# Altium schematic sheet ADC.SchDoc
size 420 x 297 mm; Address1: Address1; Address2: Address2; Address3: Address3; Address4: Address4; SheetNumber: 1; SheetTotal: 2; Scale: 1:1; Разраб.: Иванов; Обозначение документа: АБВГ.123456.001 Э3; Пров.: Петров; Утв.: Сидоров; Наименование организации: ОАО "Ваша фирма"; Перв. применение: АБВГ.123456.000; Наименование изделия 1: Плата; Наименование изделия 2: Схема электрическая; Наименование изделия 3: принципиальная; Нач. отд.: Нач. отд.; Фамилия нач. отд.: Сидоров
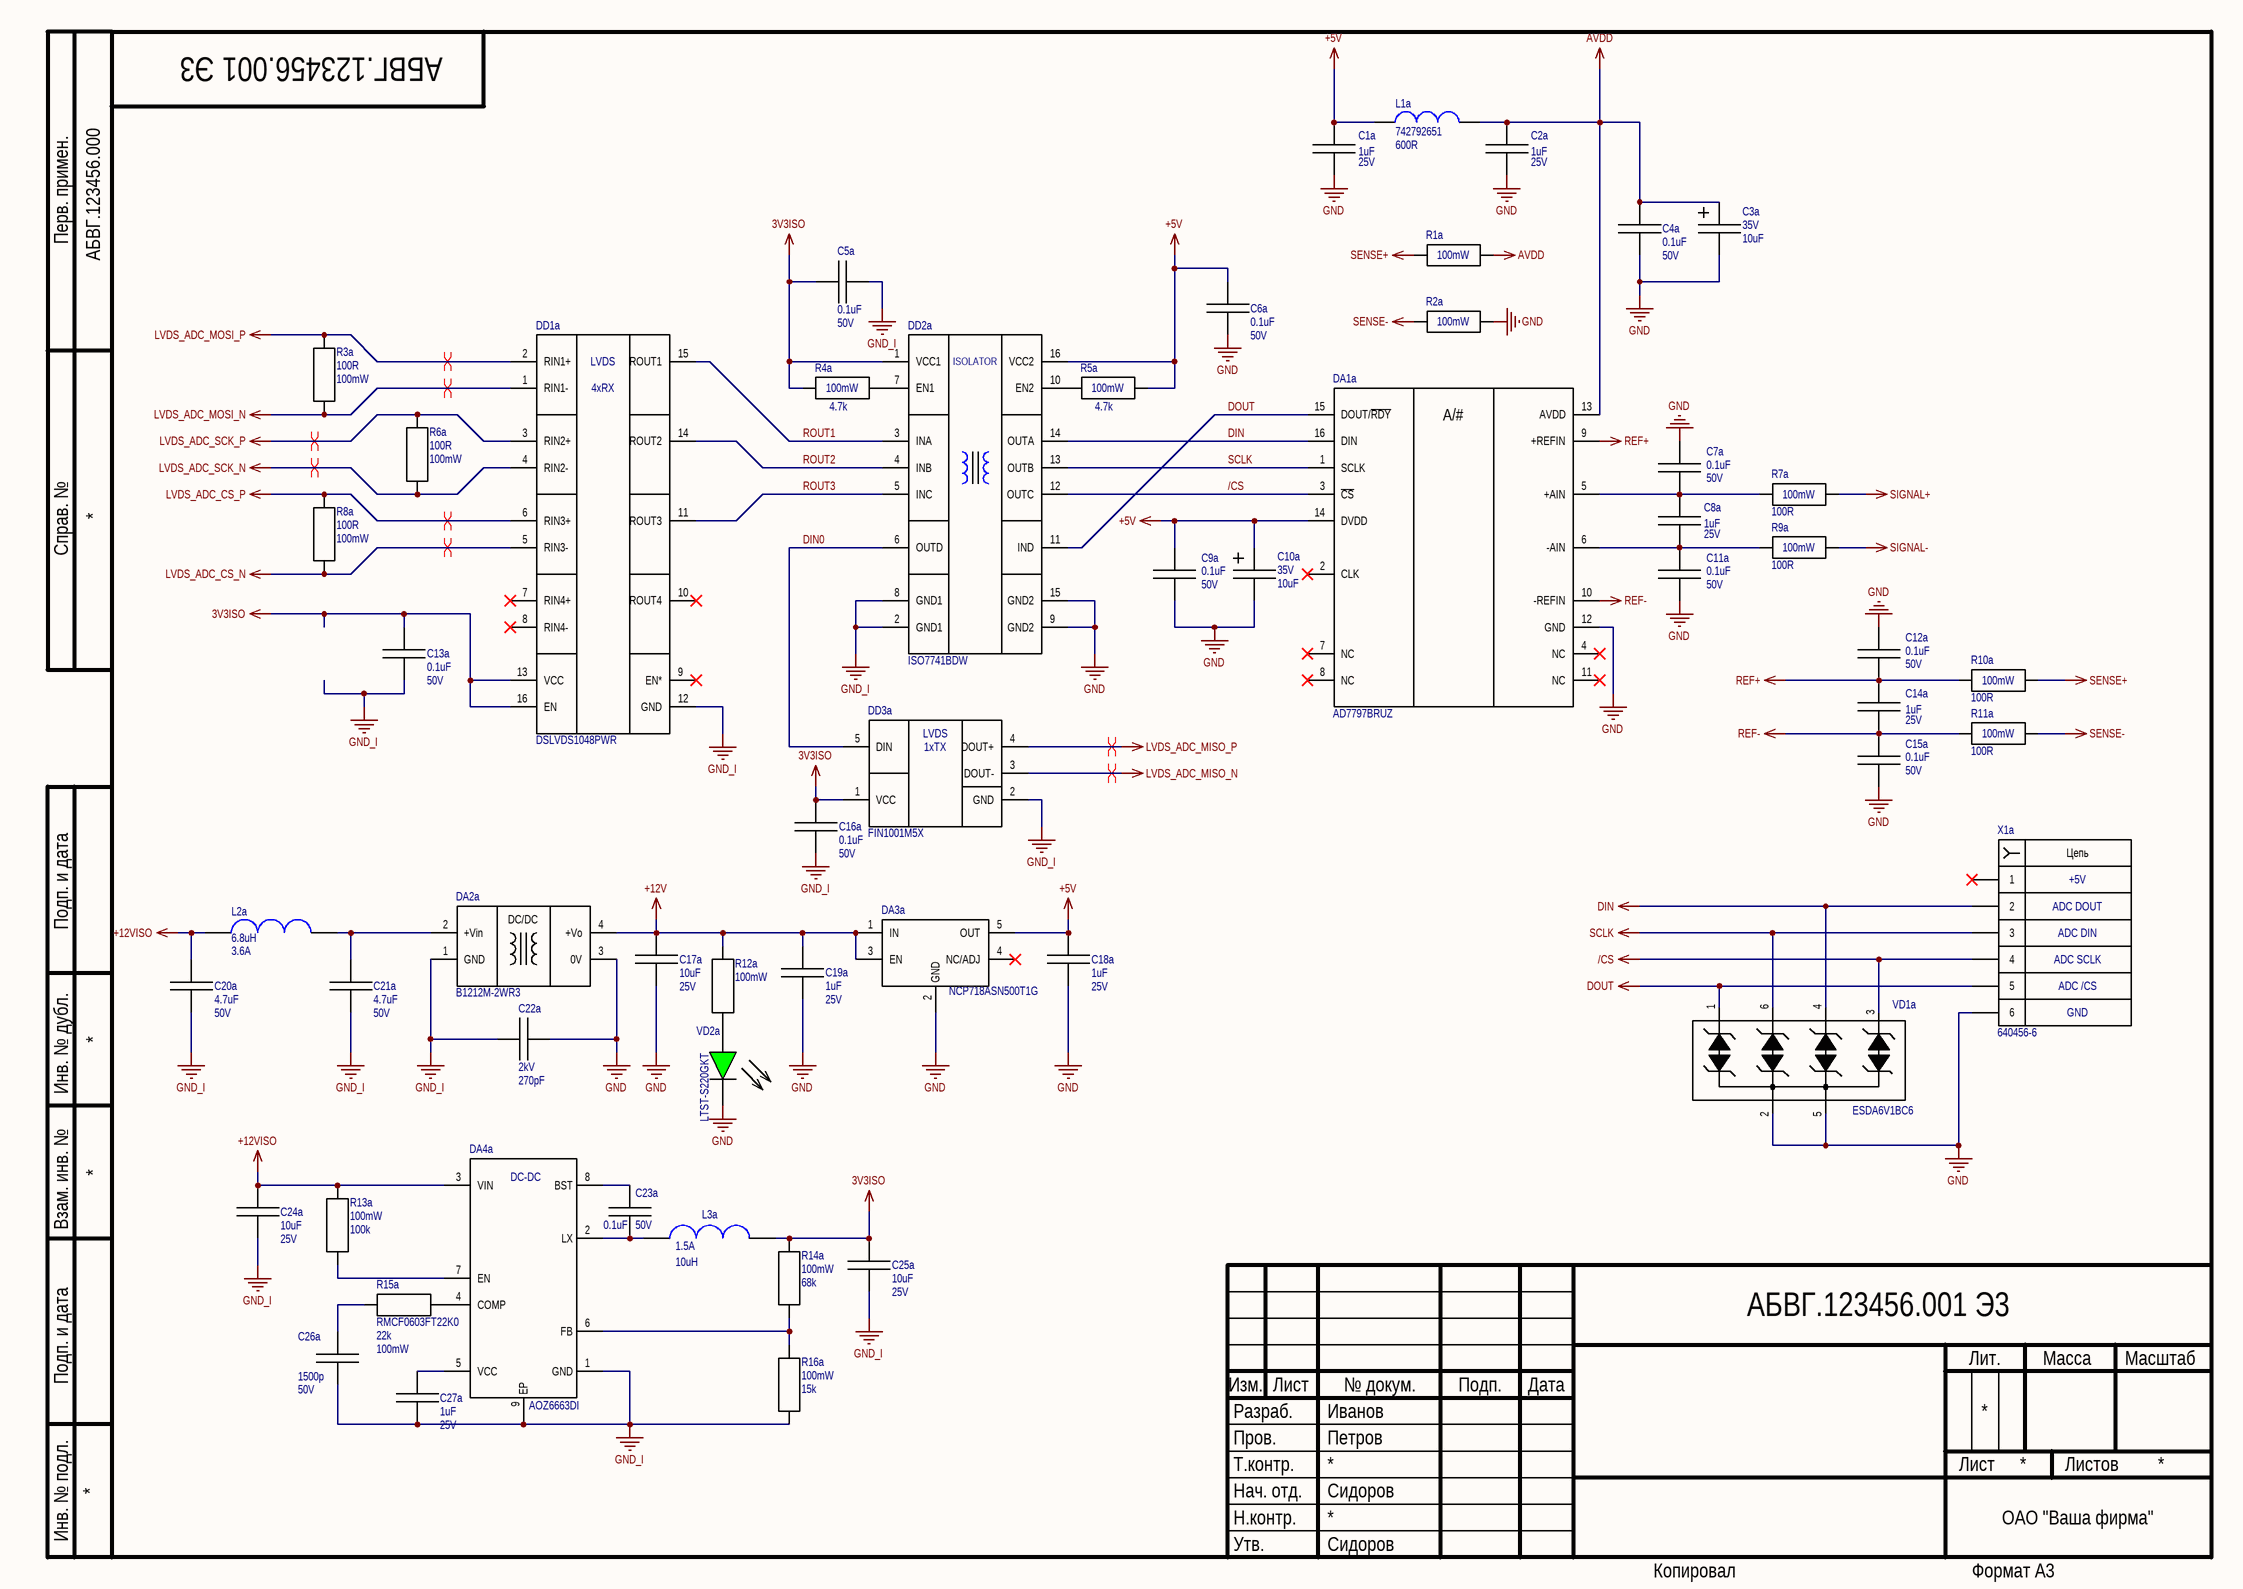
[diagram p0: ADC.SchDoc]

## Parts
C1a  Capacitance: 1uF  Rated Voltage: 25V  [CAP 0603 IPC MAX]  (hidden comment: TMK107BJ105KA-T)
C2a  Capacitance: 1uF  Rated Voltage: 25V  [CAP 0603 IPC MAX]  (hidden comment: TMK107BJ105KA-T)
C3a  Rated Voltage: 35V  Capacitance: 10uF  [CAP 2917 (D)]  (hidden comment: TAJD106M035RNJ)
C4a  Capacitance: 0.1uF  Rated Voltage: 50V  [CAP 0603 IPC MAX]  (hidden comment: GCM188R71H104KA57D)
C5a  Capacitance: 0.1uF  Rated Voltage: 50V  [CAP 0603 IPC MAX]  (hidden comment: GCM188R71H104KA57D)
C6a  Capacitance: 0.1uF  Rated Voltage: 50V  [CAP 0603 IPC MAX]  (hidden comment: GCM188R71H104KA57D)
C7a  Capacitance: 0.1uF  Rated Voltage: 50V  [CAP 0603 IPC MAX]  (hidden comment: GCM188R71H104KA57D)
C8a  Capacitance: 1uF  Rated Voltage: 25V  [CAP 0603 IPC MAX]  (hidden comment: TMK107BJ105KA-T)
C9a  Capacitance: 0.1uF  Rated Voltage: 50V  [CAP 0603 IPC MAX]  (hidden comment: GCM188R71H104KA57D)
C10a  Rated Voltage: 35V  Capacitance: 10uF  [CAP 2917 (D)]  (hidden comment: TAJD106M035RNJ)
C11a  Capacitance: 0.1uF  Rated Voltage: 50V  [CAP 0603 IPC MAX]  (hidden comment: GCM188R71H104KA57D)
C12a  Capacitance: 0.1uF  Rated Voltage: 50V  [CAP 0603 IPC MAX]  (hidden comment: GCM188R71H104KA57D)
C13a  Capacitance: 0.1uF  Rated Voltage: 50V  [CAP 0603 IPC MAX]  (hidden comment: GCM188R71H104KA57D)
C14a  Capacitance: 1uF  Rated Voltage: 25V  [CAP 0603 IPC MAX]  (hidden comment: TMK107BJ105KA-T)
C15a  Capacitance: 0.1uF  Rated Voltage: 50V  [CAP 0603 IPC MAX]  (hidden comment: GCM188R71H104KA57D)
C16a  Capacitance: 0.1uF  Rated Voltage: 50V  [CAP 0603 IPC MAX]  (hidden comment: GCM188R71H104KA57D)
C17a  Capacitance: 10uF  Rated Voltage: 25V  [CAP 1206 IPC MAX]  (hidden comment: CL31B106KAHNNNE)
C18a  Capacitance: 1uF  Rated Voltage: 25V  [CAP 0603 IPC MAX]  (hidden comment: TMK107BJ105KA-T)
C19a  Capacitance: 1uF  Rated Voltage: 25V  [CAP 0603 IPC MAX]  (hidden comment: TMK107BJ105KA-T)
C20a  Capacitance: 4.7uF  Rated Voltage: 50V  [CAP 0805 IPC MAX]  (hidden comment: CL21A475KBQNNNE)
C21a  Capacitance: 4.7uF  Rated Voltage: 50V  [CAP 0805 IPC MAX]  (hidden comment: CL21A475KBQNNNE)
C22a  Rated Voltage: 2kV  Capacitance: 270pF  [CAP RADIAL L18.0 W5.0 H10.5 P15.0]  (hidden comment: PHE448SB3270JR06)
C23a  Capacitance: 0.1uF  Rated Voltage: 50V  [CAP 0603 IPC MAX]  (hidden comment: GCM188R71H104KA57D)
C24a  Capacitance: 10uF  Rated Voltage: 25V  [CAP 1206 IPC MAX]  (hidden comment: CL31B106KAHNNNE)
C25a  Capacitance: 10uF  Rated Voltage: 25V  [CAP 1206 IPC MAX]  (hidden comment: CL31B106KAHNNNE)
C26a  Capacitance: 1500p  Rated Voltage: 50V  [CAP 0603 IPC MAX]  (hidden comment: GRM1885C1H152JA01D)
C27a  Capacitance: 1uF  Rated Voltage: 25V  [CAP 0603 IPC MAX]  (hidden comment: TMK107BJ105KA-T)
DA1a  AD7797BRUZ  [TSSOP-16]
DA2a  B1212M-2WR3  [B1212M-2WR3]
DA3a  NCP718ASN500T1G  [TSOT-23-5]
DA4a  AOZ6663DI  [DFN 3x3-8L]
DD1a  DSLVDS1048PWR  [TSSOP-16]
DD2a  ISO7741BDW  [SOIC-16 IPC MAX]
DD3a  FIN1001M5X  [SOT-23-5]
L1a  742792651  Inmedance @ 100MHz: 600R  [IND 0603 IPC MAX]
L2a  Inductance: 6.8uH  Current Rating: 3.6A  [VLS6045EX]  (hidden comment: VLS6045EX-6R8M)
L3a  Inductance: 10uH  Current Rating: 1.5A  [ASPI-4030S]  (hidden comment: ASPI-4030S-100M-T)
R1a  Rated Power: 100mW  [RES 0603 IPC MAX]  (hidden comment: RMCF0603ZT0R00)
R2a  Rated Power: 100mW  [RES 0603 IPC MAX]  (hidden comment: RMCF0603ZT0R00)
R3a  Resistance: 100R  Rated Power: 100mW  [RES 0603 IPC MAX]  (hidden comment: RMCF0603FT100R)
R4a  Rated Power: 100mW  Resistance: 4.7k  [RES 0603 IPC MAX]  (hidden comment: RMCF0603FT4K70)
R5a  Rated Power: 100mW  Resistance: 4.7k  [RES 0603 IPC MAX]  (hidden comment: RMCF0603FT4K70)
R6a  Resistance: 100R  Rated Power: 100mW  [RES 0603 IPC MAX]  (hidden comment: RMCF0603FT100R)
R7a  Resistance: 100R  Rated Power: 100mW  [RES 0603 IPC MAX]  (hidden comment: RMCF0603FT100R)
R8a  Resistance: 100R  Rated Power: 100mW  [RES 0603 IPC MAX]  (hidden comment: RMCF0603FT100R)
R9a  Resistance: 100R  Rated Power: 100mW  [RES 0603 IPC MAX]  (hidden comment: RMCF0603FT100R)
R10a  Resistance: 100R  Rated Power: 100mW  [RES 0603 IPC MAX]  (hidden comment: RMCF0603FT100R)
R11a  Resistance: 100R  Rated Power: 100mW  [RES 0603 IPC MAX]  (hidden comment: RMCF0603FT100R)
R12a  Rated Power: 100mW  [RES 0603 IPC MAX]  (hidden comment: RMCF0603FT2K00)
R13a  Power Rated: 100mW  Resistance: 100k  [RES 0603 IPC MAX]  (hidden comment: RMCF0603FT100K)
R14a  Power Rated: 100mW  Resistance: 68k  [RES 0603 IPC MAX]  (hidden comment: RMCF0603FT68K0)
R15a  RMCF0603FT22K0  Resistance: 22k  Power Rated: 100mW  [RES 0603 IPC MAX]
R16a  Power Rated: 100mW  Resistance: 15k  [RES 0603 IPC MAX]  (hidden comment: RMCF0603FT15K0)
VD1a  ESDA6V1BC6  [SOT-23-6]
VD2a  LTST-S220GKT  [0805 DIODE]
X1a  640456-6  [640456-6]

## Nets
3V3ISO: C5a.2 C13a.1 C16a.1 C25a.1 DD1a.13(VCC) DD1a.16(EN) DD2a.1(VCC1) DD3a.1(VCC) L3a.2 R4a.2 R14a.1
+5V: C1a.1 C6a.1 C9a.1 C10a.1 C18a.1 DA1a.14(DVDD) DA3a.5(OUT) DD2a.16(VCC2) L1a.1 R5a.1
+12V: C17a.1 C19a.1 DA2a.4(+Vo) DA3a.1(IN) DA3a.3(EN) R12a.2
+12VISO: C20a.1 C24a.1 DA4a.3(VIN) L2a.1 R13a.1
/CS: DA1a.3(~{CS}) DD2a.12(OUTC) VD1a.3 X1a.4
AVDD: C2a.1 C3a.1 C4a.1 DA1a.13(AVDD) L1a.2 R1a.2
DIN: DA1a.16(DIN) DD2a.14(OUTA) VD1a.4 X1a.2
DOUT: DA1a.15(DOUT/~{RDY}) DD2a.11(IND) VD1a.1 X1a.5
GND: C1a.2 C2a.2 C3a.2 C4a.2 C6a.2 C7a.1 C9a.2 C10a.2 C11a.2 C12a.1 C15a.2 C17a.2 C18a.2 C19a.2 C22a.1 DA1a.12(GND) DA2a.3(0V) DA3a.2(GND) DD2a.9(GND2) DD2a.15(GND2) R2a.2 VD1a.2 VD1a.5 VD2a.2 X1a.6
GND_I: C5a.1 C13a.2 C16a.2 C20a.2 C21a.2 C22a.2 C24a.2 C25a.2 C26a.2 C27a.2 DA2a.1(GND) DA4a.1(GND) DA4a.9(EP) DD1a.12(GND) DD2a.2(GND1) DD2a.8(GND1) DD3a.2(GND) R16a.1
LVDS_ADC_CS_N: DD1a.5(RIN3-) R8a.1
LVDS_ADC_CS_P: DD1a.6(RIN3+) R8a.2
LVDS_ADC_MISO_N: DD3a.3(DOUT-)
LVDS_ADC_MISO_P: DD3a.4(DOUT+)
LVDS_ADC_MOSI_N: DD1a.1(RIN1-) R3a.1
LVDS_ADC_MOSI_P: DD1a.2(RIN1+) R3a.2
LVDS_ADC_SCK_N: DD1a.4(RIN2-) R6a.1
LVDS_ADC_SCK_P: DD1a.3(RIN2+) R6a.2
REF+: C12a.2 C14a.1 DA1a.9(+REFIN) R10a.2
REF-: C14a.2 C15a.1 DA1a.10(-REFIN) R11a.2
SCLK: DA1a.1(SCLK) DD2a.13(OUTB) VD1a.6 X1a.3
SENSE+: R1a.1 R10a.1
SENSE-: R2a.1 R11a.1
SIGNAL+: R7a.1
SIGNAL-: R9a.1
DIN0: DD2a.6(OUTD) DD3a.5(DIN)
ROUT1: DD1a.15(ROUT1) DD2a.3(INA)
ROUT2: DD1a.14(ROUT2) DD2a.4(INB)
ROUT3: DD1a.11(ROUT3) DD2a.5(INC)
NetC7a_2: C7a.2 C8a.1 DA1a.5(+AIN) R7a.2
NetC8a_2: C8a.2 C11a.1 DA1a.6(-AIN) R9a.2
NetC21a_1: C21a.1 DA2a.2(+Vin) L2a.2
NetC23a_1: C23a.1 DA4a.8(BST)
NetC23a_2: C23a.2 DA4a.2(LX) L3a.1
NetC26a_1: C26a.1 R15a.1
NetC27a_1: C27a.1 DA4a.5(VCC)
NetDA4a_4: DA4a.4(COMP) R15a.2
NetDA4a_6: DA4a.6(FB) R14a.2 R16a.2
NetDA4a_7: DA4a.7(EN) R13a.2
NetDD2a_7: DD2a.7(EN1) R4a.1
NetDD2a_10: DD2a.10(EN2) R5a.2
NetR12a_1: R12a.1 VD2a.1

Not connected (* = marked no-connect by the designer): DA1a 2(CLK)* 4(NC)* 7(NC)* 8(NC)* 11(NC)*; DA3a 4(NC/ADJ)*; DD1a 7(RIN4+)* 8(RIN4-)* 9(EN*)* 10(ROUT4)*; X1a 1*

## Layout directives
differential pair: LVDS_ADC_CS_N, LVDS_ADC_CS_P, LVDS_ADC_MISO_N, LVDS_ADC_MISO_P, LVDS_ADC_MOSI_N, LVDS_ADC_MOSI_P, LVDS_ADC_SCK_N, LVDS_ADC_SCK_P

## Notes on the sheet
- +5V
- ADC DOUT
- ADC DIN
- ADC SCLK
- ADC /CS
- GND
- Перв. примен.
- Справ. №
- Подп. и дата
- Инв. № дубл.
- Взам. инв. №
- Разраб.
- Изм.
- Лист
- № докум.
- Подп.
- Дата
- Лит.
- Масса
- Масштаб
- Пров.
- Т.контр.
- Листов
- Инв. № подл.
- Утв.
- Н.контр.
- Копировал
- Формат А3
- (in symbol 640456-6) Цепь
- (in symbol AD7797BRUZ) A/#
- (in symbol AOZ6663DI) DC-DC
- (in symbol B1212M-2WR3) DC/DC
- (in symbol DSLVDS1048PWR) LVDS; 4xRX
- (in symbol FIN1001M5X) LVDS; 1xTX
- (in symbol ISO7741BDW) ISOLATOR

## Library data of the parts
C1a C2a C8a C14a C18a C19a C27a = TMK107BJ105KA-T: CAP SMD CER 1UF 25V X5R 0603; Manufacturer 1: Taiyo Yuden; Tolerance: 10%; Type: Multilayer Ceramic; Manufacturer Part Number 1: TMK107BJ105KA-T; Min Operating Temperature: -55°C; Max Operating Temperature: 85°C; Mounting: SM; Package: 0603; Supplier 1: Digi-Key; Supplier Part Number 1: 587-1248-1-ND
C3a C10a = TAJD106M035RNJ: CAP TANT 10UF 20% 35V 2917; Manufacturer 1: KYOCERA AVX; Type: Molded; ESR: 1 Ohm; Manufacturer Part Number 1: TAJD106M035RNJ; Min Operating Temperature: -55°C; Max Operating Temperature: 125°C; Tolerance: 20%; Size Code: 2917; Mounting: SM; Package: D; Supplier 1: Digi-Key; Supplier Part Number 1: 478-3916-1-ND
C4a C5a C6a C7a C9a C11a C12a C13a C15a C16a C23a = GCM188R71H104KA57D: CAP SMD CER 0.1UF 50V X7R 0603; Manufacturer 1: Murata Electronics; Tolerance: 10%; Type: Multilayer Ceramic; Manufacturer Part Number 1: GCM188R71H104KA57D; Min Operating Temperature: -55°C; Max Operating Temperature: 125°C; Mounting: SM; Package: 0603; Supplier 1: Digi-Key; Supplier Part Number 1: 490-4779-1-ND
C17a C24a C25a = CL31B106KAHNNNE: CAP SMD CER 10UF 25V X7R 1206; Manufacturer 1: Samsung Electro-Mechanics; Tolerance: 10%; Type: Multilayer Ceramic; Manufacturer Part Number 1: CL31B106KAHNNNE; Min Operating Temperature: -55°C; Max Operating Temperature: 125°C; Mounting: SM; Package: 1206; Supplier 1: Digi-Key; Supplier Part Number 1: 1276-1804-1-ND
C20a C21a = CL21A475KBQNNNE: CAP SMD CER 4.7UF 50V X5R 0805; Manufacturer 1: Samsung Electro-Mechanics; Tolerance: 10%; Type: Multilayer Ceramic; Manufacturer Part Number 1: CL21A475KBQNNNE; Min Operating Temperature: -55°C; Max Operating Temperature: 85°C; Mounting: SM; Package: 0805; Supplier 1: Digi-Key; Supplier Part Number 1: 1276-1248-1-ND
C22a = PHE448SB3270JR06: CAP FILM 270PF 5% 2KVDC RADIAL; Manufacturer 1: KEMET; Type: PP; Manufacturer Part Number 1: PHE448SB3270JR06; Min Operating Temperature: -55°C; Max Operating Temperature: 105°C; Tolerance: 5%; Mounting: T/H; Package: 18mm x 5mm x 10.5mm; Lead Spacing: 15mm; Supplier 1: Digi-Key; Supplier Part Number 1: 399-PHE448SB3270JR06-ND
C26a = GRM1885C1H152JA01D: CAP SMD CER 1500PF 50V C0G/NP0 0603; Manufacturer 1: Murata Electronics; Tolerance: 5%; Type: Multilayer Ceramic; Manufacturer Part Number 1: GRM1885C1H152JA01D; Min Operating Temperature: -55°C; Max Operating Temperature: 125°C; Mounting: SM; Package: 0603; Supplier 1: Digi-Key; Supplier Part Number 1: 490-1455-1-ND
DA1a = AD7797BRUZ: IC ADC 24BIT SIGMA-DELTA 16TSSOP; Manufacturer 1: Analog Devices Inc.; Number Of Bits: 24; Sampling Rate (Per Second): 123; Number of Inputs: 1; Input Type: Differential; Data Interface: SPI, DSP; Configuration: MUX-ADC; Reference Type: External; Min Supply Voltage: 2.7V; Max Supply Current: 325uA; Max Supply Voltage: 5.25V; Manufacturer Part Number 1: AD7797BRUZ; Architecture: Sigma-Delta; Min Operating Temperature: -40°C; Max Operating Temperature: 85°C; Package: 16-TSSOP; Supplier 1: Digi-Key; Supplier Part Number 1: 505-AD7797BRUZ-ND
DA2a = B1212M-2WR3: DC DC CONVERTER 12V 2W; Manufacturer 1: Mornsun America, LLC; Max Input Voltage DC: 13.2V; Min Input Voltage DC: 10.8V; Max Output Current: 167mA; Efficiency: 86%; Output Voltage Ripple: 180mV; Operating Frequency: 260kHz; Output Voltage DC: 12V; Power Rating: 2W; Application: ITE (Commercial); Min Operating Temperature: +85℃; Max Operating Temperature: -40℃; Mounting Type: T/H; Pins: 4; Size: L11.6W7.55H10.16P2.54; Help URL: https://www.mornsun-power.com/html/pdf/B1212M-2WR3.html; Manufacturer Part Number 1: B1212M-2WR3; Supplier 1: Digi-Key; Supplier Part Number 1: 2725-B1212M-2WR3-ND
DA3a = NCP718ASN500T1G: IC REG LINEAR 5V 300MA TSOT23-5; Manufacturer 1: onsemi; Max Input Voltage: 24V; Voltage Dropout: 0.49V; Supply Current: 300uA; Manufacterur Part Number 1: NCP718ASN500T1G; Min Operating Temperature: -40°C; Max Operating Temperature: 125°C; Output Voltage: 5V; Max Output Current: 300mA; Mounting: SM; Package: TSOT-23-5; Supplier 1: Digi-Key; Supplier Part Number 1: NCP718ASN500T1GOSCT-ND
DA4a = AOZ6663DI: IC REG BUCK ADJ 3A 8DFN; Manufacturer 1: Alpha & Omega Semiconductor Inc.; Min Input Voltage: 4.5V; Max Input Voltage: 20V; Min Output Voltage: 0.6V; Max Output Voltage: 7V; Max Operating Frequency: 750kHz; Max Pulsed Current: 3.2A; Supplier 1: Digi-Key; Supplier Part Number 1: 785-1855-1-ND; Manufacturer Part Nubmer 1: AOZ6663DI; Type: Buck
DD1a = DSLVDS1048PWR: IC RECEIVER LVDS FULL 0/4 16TSSOP; Manufacturer 1: Texas Instruments; Number Of Receivers: 4; Number Of Drivers: 0; Data Rate: 400Mbps; Voltage Supply Range: 3...3.6V; Manufacturer Part Number 1: DSLVDS1048PWR; Min Operating Temperature: -40°C; Max Operating Temperature: 85°C; Package: 16-TSSOP; Mounting: SM; Supplier 1: Digi-Key; Supplier Part Number 1: 296-51106-1-ND
DD2a = ISO7741BDW: DIG ISO - MYNA - QUAD; Manufacturer 1: Texas Instruments; Number Of Channels: 4; Channel Type: Unidirectional; Number Of Inputs/Outputs: 3/1; Isolation Voltage: 5000Vrms; Data Rate: 100Mbps; Voltage Supply: 2.25V ~ 5.5V; Manufacturer Part Number 1: ISO7741BDW; Min Operating Temperature: -55°C; Max Operating Temperature: 125°C; Package: 16-SOIC; Mounting: SM; Supplier 1: Digi-Key; Supplier Part Number 1: 296-ISO7741BDW-ND
DD3a = FIN1001M5X: IC DRIVER LVDS 1/0 SOT23-5; Manufacturer 1: onsemi; Number Of Receivers: 0; Number Of Drivers: 1; Data Rate: 600Mbps; Voltage Supply Range: 3...3.6V; Manufacturer Part Number 1: FIN1001M5X; Min Operating Temperature: -40°C; Max Operating Temperature: 125°C; Package: SOT-23-5; Mounting: SM; Supplier 1: Digi-Key; Supplier Part Number 1: FIN1001M5XCT-ND
L1a = 742792651: FERRITE BEAD 600 OHM 0603 1LN; Manufacturer 1: Würth Elektronik; DCR: 200mOhm; Rated Current: 1A; Manufacturer Part Number 1: 742792651; Min Operating Temperature: -55°C; Max Operating Temperature: 125°C; Supplier 1: Digi-Key; Supplier Part Number 1: 732-1593-1-ND; Package: 0603
L2a = VLS6045EX-6R8M: FIXED IND 6.8UH 3.6A 36 MOHM SMD; Manufacturer 1: TDK Corporation; Saturation Current: 4.7A; Shielding: Yes; DCR: 36mOhm; Manufacturer Part Number 1: VLS6045EX-6R8M; Min Operating Temperature: -40°C; Max Operating Temperature: 105°C; Supplier 1: Digi-Key; Supplier Part Number 1: 445-173057-1-ND
L3a = ASPI-4030S-100M-T: FIXED IND 10UH 1.5A 100 MOHM SMD; Manufacturer 1: Abracon LLC; Saturation Current: 1.95A; Shielding: Yes; Manufacturer Part Number 1: ASPI-4030S-100M-T; DCR: 100mOhm; Min Operating Temperature: -40°C; Max Operating Temperature: 125°C; Supplier 1: Digi-Key; Supplier Part Number 1: 535-12314-1-ND
R1a R2a = RMCF0603ZT0R00: RES SMD 0 OHM 1% 1/10W 0603; Manufacturer 1: Stackpole Electronics Inc; Rated Voltage: 75V; Qualification: AEC-Q200; Resistance: 0; Manufacturer Part Number 1: RMCF0603ZT0R00; Tolerance: 1%; Package: 0603; Min Operating Temperature: -55°C; Max Operating Temperature: 155°C; Supplier 1: Digi-Key; Supplier Part Number 1: RMCF0603ZT0R00CT-ND
R3a R6a R7a R8a R9a R10a R11a = RMCF0603FT100R: RES SMD 100 OHM 1% 1/10W 0603; Manufacturer 1: Stackpole Electronics Inc; Rated Voltage: 75V; Qualification: AEC-Q200; Manufacturer Part Number 1: RMCF0603FT100R; Tolerance: 1%; Package: 0603; Min Operating Temperature: -55°C; Max Operating Temperature: 155°C; Supplier 1: Digi-Key; Supplier Part Number 1: RMCF0603FT100RCT-ND
R4a R5a = RMCF0603FT4K70: RES SMD 4.7k OHM 1% 1/10W 0603; Manufacturer 1: Stackpole Electronics Inc; Rated Voltage: 75V; Qualification: AEC-Q200; Manufacturer Part Number 1: RMCF0603FT4K70; Tolerance: 1%; Package: 0603; Min Operating Temperature: -55°C; Max Operating Temperature: 155°C; Supplier 1: Digi-Key; Supplier Part Number 1: RMCF0603FT4K70CT-ND
R12a = RMCF0603FT2K00: RES SMD 2K OHM 1% 1/10W 0603; Manufacturer 1: Stackpole Electronics Inc; Rated Voltage: 75V; Qualification: AEC-Q200; Manufacturer Part Number 1: RMCF0603FT2K00; Tolerance: 1%; Package: 0603; Min Operating Temperature: -55°C; Max Operating Temperature: 155°C; Resistance: 2k; Supplier 1: Digi-Key; Supplier Part Number 1: RMCF0603FT2K00CT-ND
R13a = RMCF0603FT100K: RES SMD 100K OHM 5% 1/10W 0603; Manufacturer 1: Stackpole Electronics Inc; Voltage Rated: 75V; Manufacturer Part Number 1: RMCF0603FT100K; Min Operating Temperature: -55°C; Max Operating Temperature: 155°C; Tolerance: 5%; Package: 0603; Ratings: AEC-Q200; Supplier 1: Digi-Key; Supplier Part Number 1: RMCF0603FT100KCT-ND
R14a = RMCF0603FT68K0: RES SMD 68K OHM 1% 1/10W 0603; Manufacturer 1: Stackpole Electronics Inc; Voltage Rated: 75V; Manufacturer Part Number 1: RMCF0603FT68K0; Min Operating Temperature: -55°C; Max Operating Temperature: 155°C; Tolerance: 1%; Package: 0603; Ratings: AEC-Q200; Supplier 1: Digi-Key; Supplier Part Number 1: RMCF0603FT68K0CT-ND
R15a = RMCF0603FT22K0: RES SMD 22K OHM 1% 1/10W 0603; Manufacturer 1: Stackpole Electronics Inc; Min Operating Temnperature: -55°C; Voltage Rated: 75V; Manufacturer Part Number 1: RMCF0603FT22K0; Max Operating Temperature: 155°C; Tolerance: 1%; Package: 0603; Mounting: SM; Pins: 2; Rating: AEC-Q200; Supplier 1: Digi-Key; Supplier Part Number 1: RMCF0603FT22K0CT-ND
R16a = RMCF0603FT15K0: RES SMD 15K OHM 1% 1/10W 0603; Manufacturer 1: Stackpole Electronics Inc; Voltage Rated: 75V; Manufacturer Part Number 1: RMCF0603FT15K0; Min Operating Temperature: -55°C; Max Operating Temperature: 155°C; Tolerance: 1%; Package: 0603; Ratings: AEC-Q200; Supplier 1: Digi-Key; Supplier Part Number 1: RMCF0603FT15K0CT-ND
VD1a = ESDA6V1BC6: TVS DIODE 5VWM SOT23-6; Manufacturer 1: STMicroelectronics; Voltage - Reverse Standoff (Typ): 5V; Voltage - Breakdown (Min): 6.1V; Type: Biderectional; Number Of Chanels: 4; Max Pulse Power: 80W; Manufacturer Part Number 1: ESDA6V1BC6; Mounting: SM; Max Operating Temperature: 125°C; Min Operating Temperature: -40°C; Package: SOT-23-6; Supplier 1: Digi-Key; Supplier Part Number 1: 497-6635-1-ND
VD2a = LTST-S220GKT: LED GREEN CLEAR SMD R/A; Manufacturer 1: Lite-On Inc.; Max Continious Current: 30mA; Max Pulse Current: 120mA; Reverse Voltage: 5V; Power Dissipation: 100mW; Forward Voltage: 2.2V; Manufacturer Part Number 1: LTST-S220GKT; Max Operating Temperature: +85°C; Package: 0805; Supplier 1: Digi-Key; Supplier Part Number 1: 160-1218-1-ND
X1a = 640456-6: CONN HEADER VERT 6POS 2.54MM; Manufacturer 1: TE Connectivity AMP Connectors; Rated Voltage: 250V; Rated Current: 10A; Suitable Connctor: 3-640441-6; Min Operating Temperatire: -55℃; Max Operating Temperature: 105℃; Pitch: 2.54mm; Pins: 6; Manufacturer Part Number 1: 640456-6; Max Length: 15.24; Max Width: 5.715; Max Height: 13.59mm; Supplier 1: Digi-Key; Supplier Part Number 1: A1923-ND